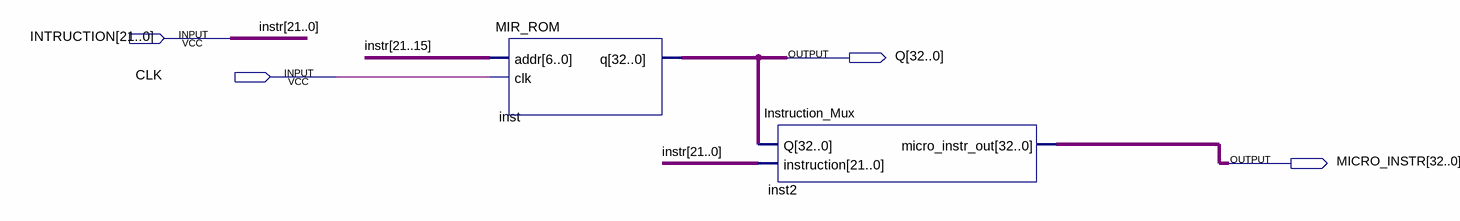
[diagram p0: schematic sheet]
// Quartus schematic MicroInstrGenerator.bdf as structural Verilog: 2 symbols, 4 pins
module MicroInstrGenerator (
  input  [21:0] INTRUCTION,
  input  CLK,
  output [32:0] Q,
  output [32:0] MICRO_INSTR
);

  MIR_ROM inst (.addr(INTRUCTION[21:15]), .clk(CLK), .q(Q));
  Instruction_Mux inst2 (.Q(Q), .instruction(INTRUCTION), .micro_instr_out(MICRO_INSTR));

  // Other names for the same wires on the sheet: instr[21:0] = INTRUCTION
endmodule
